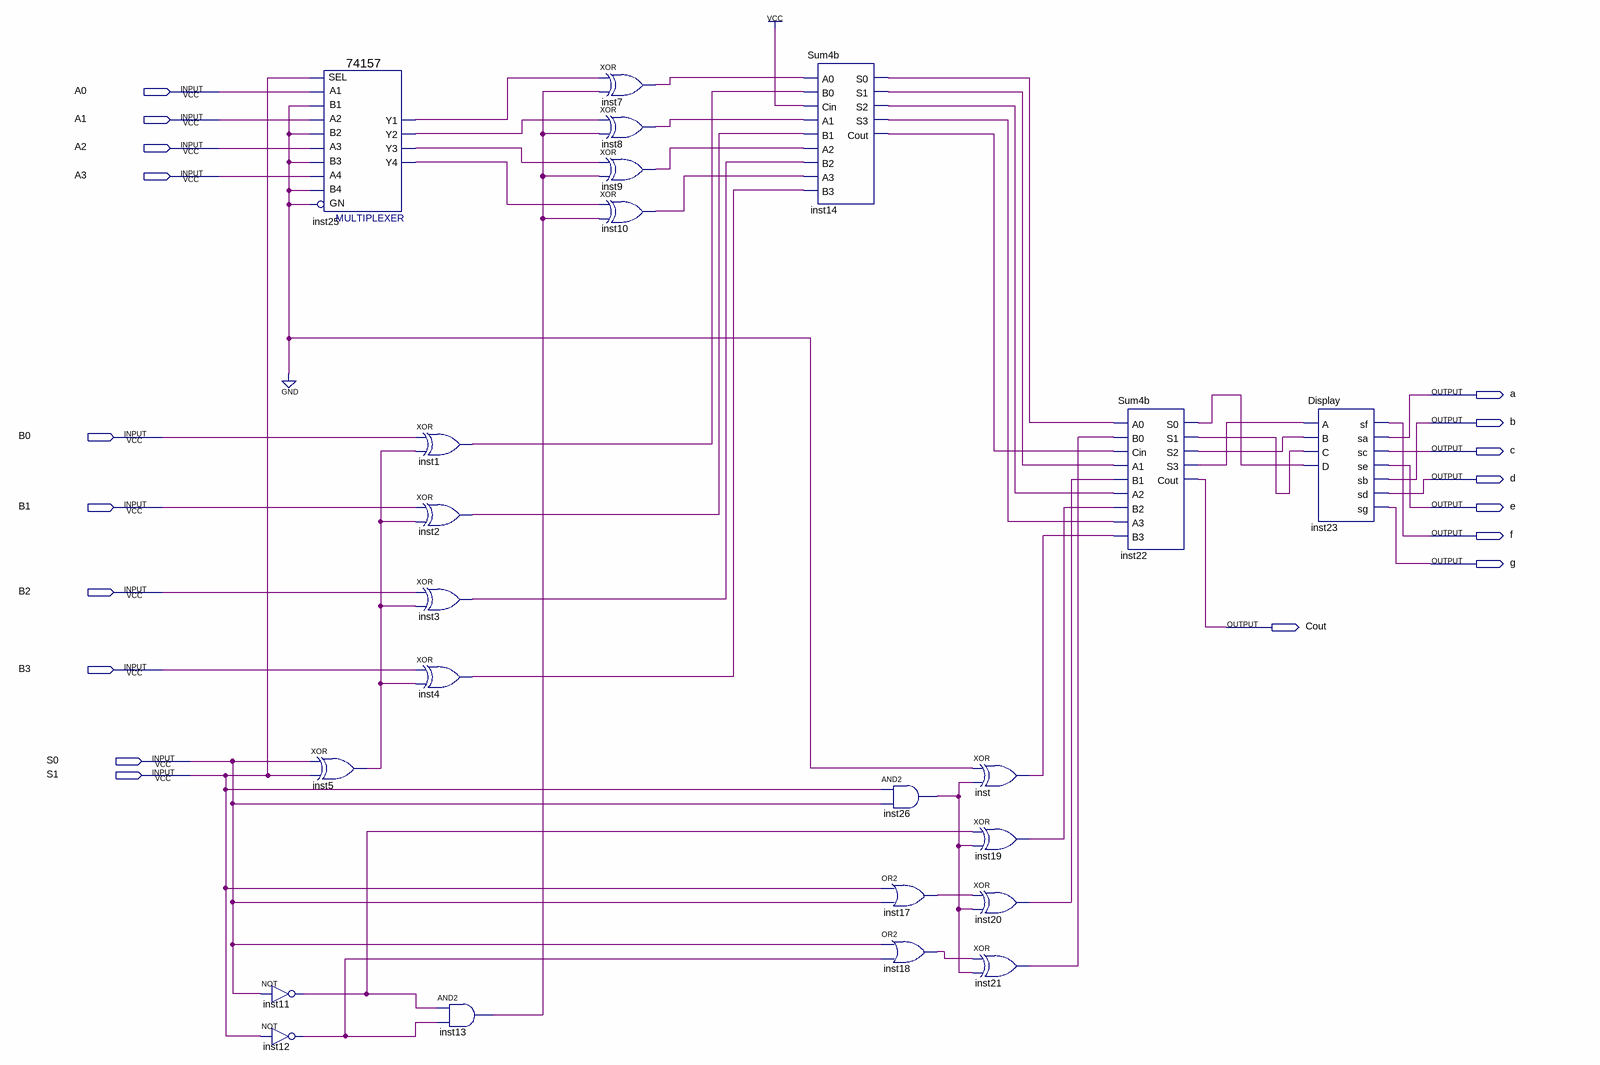
[diagram p0: schematic sheet]
// Quartus schematic PartAritmetica.bdf as structural Verilog: 23 symbols, 18 pins
module PartAritmetica (
  input  A0,
  input  A1,
  input  A2,
  input  A3,
  input  B0,
  input  B1,
  input  B2,
  input  B3,
  input  S0,
  input  S1,
  output a,
  output b,
  output c,
  output d,
  output e,
  output f,
  output g,
  output Cout
);

  wire inst1_out, inst2_out, inst3_out, inst4_out, inst5_out, inst7_out, inst8_out, inst9_out, inst10_out,
       inst11_out, inst12_out, inst13_out, inst14_cout, inst14_s0, inst14_s1, inst14_s2, inst14_s3,
       inst17_out, inst18_out, inst19_out, inst20_out, inst21_out, inst22_s0, inst22_s1, inst22_s2,
       inst22_s3, inst25_y1, inst25_y2, inst25_y3, inst25_y4, inst26_out, inst_out;

  not inst11 (inst11_out, S0);
  not inst12 (inst12_out, S1);
  \74157  inst25 (
    .A1(A0), .B1(1'b0), .SEL(S1), .B2(1'b0), .A3(A2), .B3(1'b0), .A2(A1), .B4(1'b0), .GN(1'b0), .A4(A3),
    .Y2(inst25_y2), .Y1(inst25_y1), .Y4(inst25_y4), .Y3(inst25_y3));
  xor inst5 (inst5_out, S0, S1);
  xor inst1 (inst1_out, B0, inst5_out);
  xor inst2 (inst2_out, B1, inst5_out);
  xor inst3 (inst3_out, B2, inst5_out);
  xor inst4 (inst4_out, B3, inst5_out);
  and inst13 (inst13_out, inst11_out, inst12_out);
  xor inst7 (inst7_out, inst25_y1, inst13_out);
  xor inst8 (inst8_out, inst25_y2, inst13_out);
  xor inst9 (inst9_out, inst25_y3, inst13_out);
  xor inst10 (inst10_out, inst25_y4, inst13_out);
  Sum4b inst14 (
    .A0(inst7_out), .B0(inst1_out), .Cin(1'b1), .A1(inst8_out), .B1(inst2_out), .A2(inst9_out),
    .B2(inst3_out), .A3(inst10_out), .B3(inst4_out), .S0(inst14_s0), .S1(inst14_s1), .S2(inst14_s2),
    .S3(inst14_s3), .Cout(inst14_cout));
  and inst26 (inst26_out, S1, S0);
  or inst17 (inst17_out, S1, S0);
  or inst18 (inst18_out, S0, inst12_out);
  xor inst (inst_out, 1'b0, inst26_out);
  xor inst19 (inst19_out, inst11_out, inst26_out);
  xor inst20 (inst20_out, inst17_out, inst26_out);
  xor inst21 (inst21_out, inst18_out, inst26_out);
  Sum4b inst22 (
    .A0(inst14_s0), .B0(inst21_out), .Cin(inst14_cout), .A1(inst14_s1), .B1(inst20_out), .A2(inst14_s2),
    .B2(inst19_out), .A3(inst14_s3), .B3(inst_out), .S0(inst22_s0), .S1(inst22_s1), .S2(inst22_s2),
    .S3(inst22_s3), .Cout(Cout));
  Display inst23 (
    .A(inst22_s3), .B(inst22_s2), .C(inst22_s1), .D(inst22_s0), .sf(f), .sa(a), .sc(c), .se(e), .sb(b),
    .sd(d), .sg(g));
endmodule
